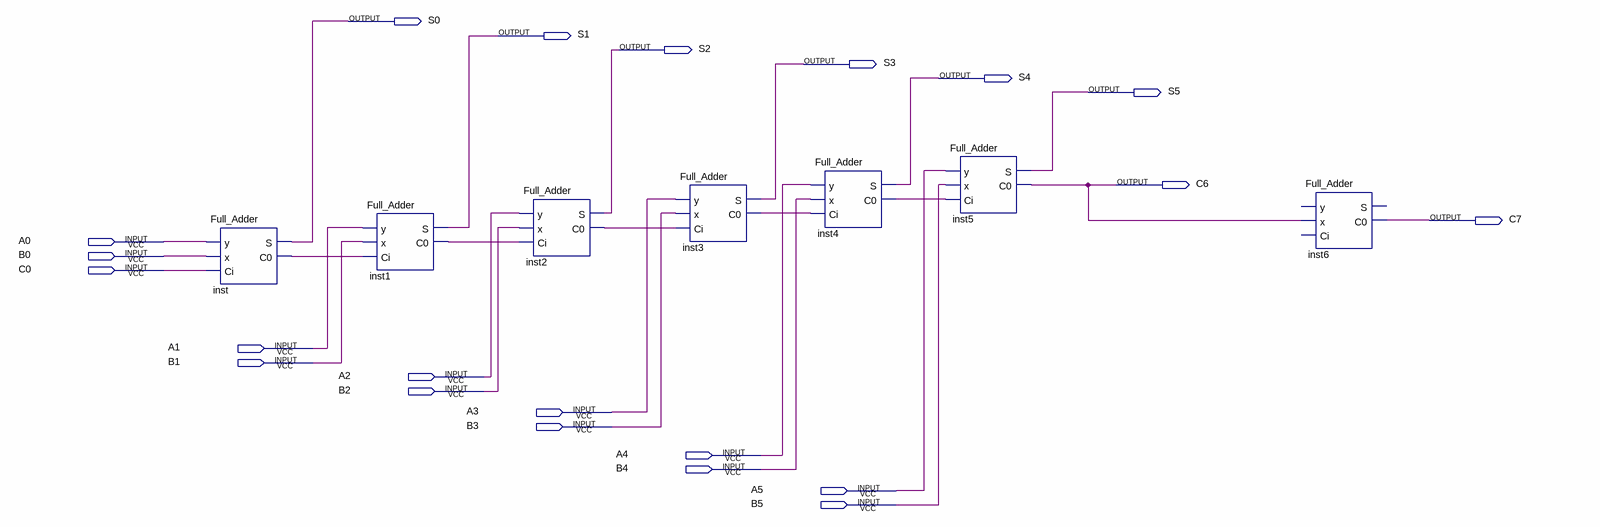
[diagram p0: schematic sheet]
// Quartus schematic 6bit_Full_Adder.bdf as structural Verilog: 7 symbols, 21 pins
module \6bit_Full_Adder  (
  input  A0,
  input  B0,
  input  C0,
  input  A1,
  input  B1,
  input  A2,
  input  B2,
  input  A3,
  input  B3,
  input  A4,
  input  B4,
  input  A5,
  input  B5,
  output S0,
  output S1,
  output S2,
  output S3,
  output S4,
  output S5,
  output C6,
  output C7
);

  wire inst1_c0, inst2_c0, inst3_c0, inst4_c0, inst_c0;

  Full_Adder inst (.y(A0), .x(B0), .Ci(C0), .S(S0), .C0(inst_c0));
  Full_Adder inst1 (.y(A1), .x(B1), .Ci(inst_c0), .S(S1), .C0(inst1_c0));
  Full_Adder inst2 (.y(A2), .x(B2), .Ci(inst1_c0), .S(S2), .C0(inst2_c0));
  Full_Adder inst3 (.y(A3), .x(B3), .Ci(inst2_c0), .S(S3), .C0(inst3_c0));
  Full_Adder inst4 (.y(A4), .x(B4), .Ci(inst3_c0), .S(S4), .C0(inst4_c0));
  Full_Adder inst5 (.y(A5), .x(B5), .Ci(inst4_c0), .S(S5), .C0(C6));
  Full_Adder inst6 (.x(C6), .C0(C7));  // open: y, Ci, S
endmodule
